# Altium schematic sheet 1_AT-Link-EZ-V1.4.schdoc
size 307 x 218 mm; Symbol: Artery_A4; Device: Artery_A4; @Project Name: AT-START-F422/F426; @Page Count: 4; @Create Date: 2025-04-14; Company: Artery Technology; Drawed: SD; Version: 1.0; Page Size: A4; @Update Date: 2025-04-14; @Page No: 1; @Schematic Name: AT-START-F426-V1.0; @Page Name: AT-Link-EZ-V1.4; Title Block Position: 3; Width: 1170; Height: 825; Region Start: 1; X Region Count: 6; Y Region Count: 4; Blade Width: 10; @Board Name: AT-START-F426-V1.0; @Create Time: 11:42:26; @Update Time: 14:57:23
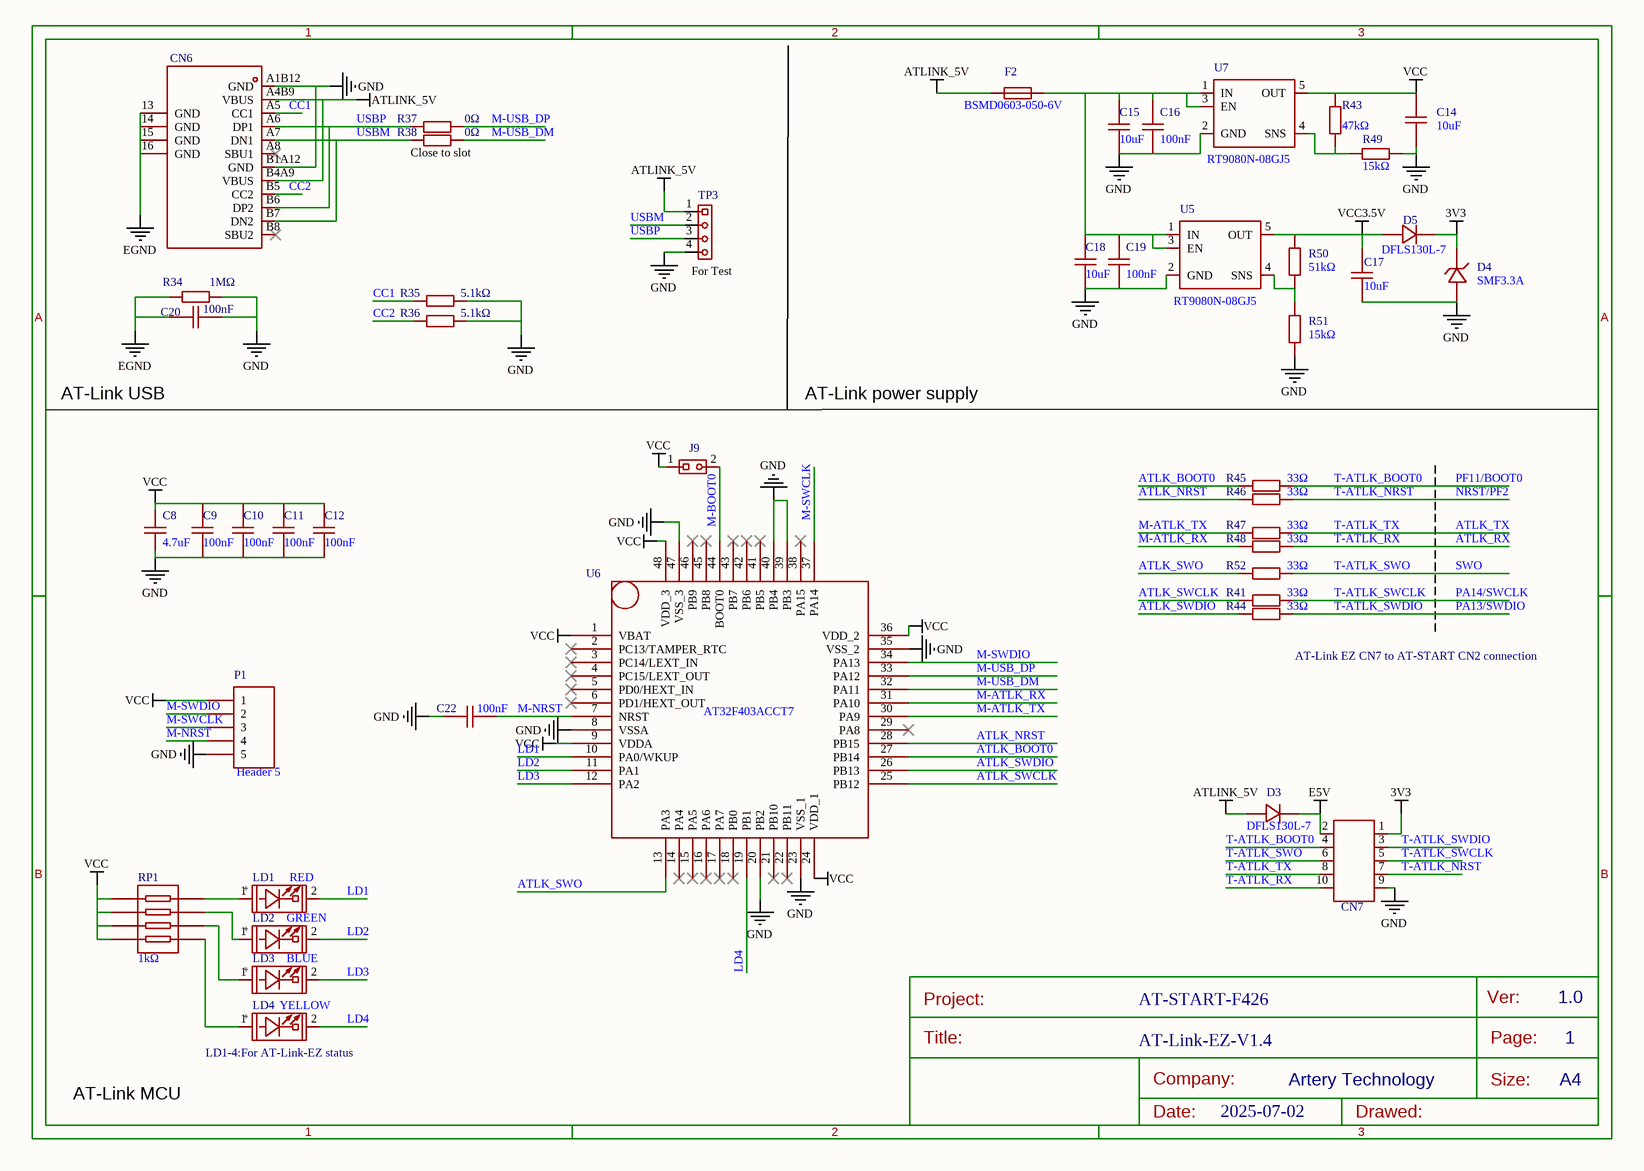
[diagram p0: 1_AT-Link-EZ-V1.4.schdoc]

## Parts
C8  4.7uF  [C0603]
C9  100nF  [C0603]
C10  100nF  [C0603]
C11  100nF  [C0603]
C12  100nF  [C0603]
C14  10uF  [C0603]
C15  10uF  [C0603]
C16  100nF  [C0603]
C17  10uF  [C0603]
C18  10uF  [C0603]
C19  100nF  [C0603]
C20  value 100nF  [C0603]
C22  100nF  [C0603]
CN6  (no value)  [USB-C-SMD_TYPEC-304-BCP16]
CN7  CON10  [HDR2X5]  (value not drawn)
D3  DFLS130L-7  [POWERDI-123_L2.8-W1.8-LS3.7-RD]
D4  SMF3.3A  [SOD-123FL_L2.8-W1.8-LS3.8-RD]
D5  DFLS130L-7  [POWERDI-123_L2.8-W1.8-LS3.7-RD]
F2  BSMD0603-050-6V  [F0603]
J9  1X2P_2.54M  [HDR1X2]  (value not drawn)
LD1  RED  [LED0603]
LD2  GREEN  [LED0603]
LD3  BLUE  [LED0603]
LD4  YELLOW  [LED0603]
P1  Header 5  [HDR1X5]
R34  value 1MΩ  [R0603]
R35  value 5.1kΩ  [R0603]
R36  value 5.1kΩ  [R0603]
R37  value 0Ω  [R0603]
R38  value 0Ω  [R0603]
R41  33Ω  [R0603]
R43  47kΩ  [R0603]
R44  33Ω  [R0603]
R45  33Ω  [R0603]
R46  33Ω  [R0603]
R47  33Ω  [R0603]
R48  33Ω  [R0603]
R49  15kΩ  [R0603]
R50  51kΩ  [R0603]
R51  15kΩ  [R0603]
R52  33Ω  [R0603]
RP1  1kΩ  [RES-ARRAY-SMD_0603-8P-L3.2-W1.6-BL]
TP3  1X4P_2.54F  [HDR1X4 - TOP]  (value not drawn)
U5  RT9080N-08GJ5  [SOT-23-5]
U6  AT32F403ACCT7  [LQFP48 - 2]
U7  RT9080N-08GJ5  [SOT-23-5]

## Nets
3V3: CN7.1 D4.1(C) D5.1
ATLINK_5V: CN6.A4B9(VBUS) CN6.B4A9(VBUS) D3.2 F2.1 TP3.1
E5V: CN7.2 D3.1
EGND: C20.2 CN6.13(GND) CN6.14(GND) CN6.15(GND) CN6.16(GND) R34.1
GND: C8.1 C9.1 C10.1 C11.1 C12.1 C14.1 C15.1 C16.1 C17.1 C18.1 C19.1 C20.1 C22.1 CN6.A1B12(GND) CN6.B1A12(GND) CN7.9 D4.2(A) P1.5 R34.2 R35.2 R36.2 R49.2 R51.2 TP3.4 U5.2(GND) U6.8(VSSA) U6.20(PB2) U6.23(VSS_1) U6.35(VSS_2) U6.39(PB3) U6.40(PB4) U6.47(VSS_3) U7.2(GND)
VCC: C8.2 C9.2 C10.2 C11.2 C12.2 C14.2 J9.1 P1.1 R43.1 RP1.1 RP1.2 RP1.3 RP1.4 U6.1(VBAT) U6.9(VDDA) U6.24(VDD_1) U6.36(VDD_2) U6.48(VDD_3) U7.5(OUT)
VCC3.5V: C17.2 D5.2 R50.1 U5.5(OUT)
ATLK_BOOT0: R45.1 U6.27(PB14)
ATLK_NRST: R46.1 U6.28(PB15)
ATLK_RX: CN7.10 R48.2  [also labelled T-ATLK_RX]
ATLK_SWCLK: R41.1 U6.25(PB12)
ATLK_SWDIO: R44.1 U6.26(PB13)
ATLK_SWO: R52.1 U6.13(PA3)
ATLK_TX: CN7.8 R47.2  [also labelled T-ATLK_TX]
CC1: CN6.A5(CC1) R35.1
CC2: CN6.B5(CC2) R36.1
LD1: LD1.2(CATHODE) U6.10(PA0/WKUP)
LD2: LD2.2(CATHODE) U6.11(PA1)
LD3: LD3.2(CATHODE) U6.12(PA2)
LD4: LD4.2(CATHODE) U6.19(PB1)
M-ATLK_RX: R48.1 U6.31(PA10)
M-ATLK_TX: R47.1 U6.30(PA9)
M-BOOT0: J9.2 U6.44(BOOT0)
M-NRST: C22.2 P1.4 U6.7(NRST)
M-SWCLK: P1.3 U6.37(PA14)
M-SWDIO: P1.2 U6.34(PA13)
M-USB_DM: R38.2 U6.32(PA11)
M-USB_DP: R37.2 U6.33(PA12)
NRST/PF2: CN7.7 R46.2  [also labelled T-ATLK_NRST]
PA13/SWDIO: CN7.3 R44.2  [also labelled T-ATLK_SWDIO]
PA14/SWCLK: CN7.5 R41.2  [also labelled T-ATLK_SWCLK]
PF11/BOOT0: CN7.4 R45.2  [also labelled T-ATLK_BOOT0]
SWO: CN7.6 R52.2  [also labelled T-ATLK_SWO]
USBM: CN6.A7(DN1) CN6.B7(DN2) R38.1 TP3.2
USBP: CN6.A6(DP1) CN6.B6(DP2) R37.1 TP3.3
NetC15_2: C15.2 C16.2 C18.2 C19.2 F2.2 U5.1(IN) U5.3(EN) U7.1(IN) U7.3(EN)
NetLD1_1: LD1.1(ANODE) RP1.8
NetLD2_1: LD2.1(ANODE) RP1.7
NetLD3_1: LD3.1(ANODE) RP1.6
NetLD4_1: LD4.1(ANODE) RP1.5
NetR43_2: R43.2 R49.1 U7.4(SNS)
NetR50_2: R50.2 R51.1 U5.4(SNS)

Not connected (* = marked no-connect by the designer): CN6 A8(SBU1)* B8(SBU2)*; U6 2(PC13/TAMPER_RTC)* 3(PC14/LEXT_IN)* 4(PC15/LEXT_OUT)* 5(PD0/HEXT_IN)* 6(PD1/HEXT_OUT)* 14(PA4)* 15(PA5)* 16(PA6)* 17(PA7)* 18(PB0)* 21(PB10)* 22(PB11)* 29(PA8)* 38(PA15)* 41(PB5)* 42(PB6)* 43(PB7)* 45(PB8)* 46(PB9)*

## Notes on the sheet
- (near R38) Close to slot
- (near TP3) For Test
- AT-Link USB
- AT-Link power supply
- AT-Link EZ CN7 to AT-START CN2 connection
- (near LD4) LD1-4:For AT-Link-EZ status
- AT-START-F426
- AT-Link MCU
- 2025-07-02
- 1
- 2
- 3
- A
- B
- Title:
- Project:
- AT-Link-EZ-V1.4
- Page:
- Ver:
- 1.0
- Date:
- Company:
- Drawed:
- Artery Technology
- Size:
- A4
- (in symbol BLUE) +
- (in symbol GREEN) +
- (in symbol RED) +
- (in symbol YELLOW) +

## Library data of the parts
C8 = CL10A475KO8NNNC: Manufacturer: SAMSUNG(三星); Add into BOM: yes; Tolerance: ±10%; Voltage Rated: 16V; Temperature Coefficient: X5R; Origin Footprint 2: 0603; Origin Footprint 3: 0402; Origin Footprint 4: C2512; Origin Footprint 5: 1608[0603]; Origin Footprint 6: C1210; Symbol: CL10A475KO8NNNC; Device: CL10A475KO8NNNC; Supplier: LCSC; Manufacturer Part: CL10A475KO8NNNC; Value: 4.7uF; Supplier Part: C19666; JLCPCB Part Class: Basic Part; LCSC Part Name: 4.7uF ±10% 16V; Supplier Footprint: 0603; Datasheet: https://atta.szlcsc.com/upload/public/pdf/source/20160218/1457707763339.pdf; Convert to PCB: yes; Origin Footprint 1: C0603; Design Item ID: Cap Semi; Library Name: PcbLib; Published: 8-Jun-2000; LatestRevisionDate: 29-May-2009; LatestRevisionNote: IPC-7351 Footprint Added.; PackageReference: C1206; Publisher: Altium Limited; PackageDescription: Chip Capacitor
C9-C12 = CC0603KRX7R9BB104: Manufacturer: YAGEO(国巨); Add into BOM: yes; Tolerance: ±10%; Voltage Rated: 50V; Temperature Coefficient: X7R; Origin Footprint 2: 0603; Origin Footprint 3: 0402; Origin Footprint 4: C2512; Origin Footprint 5: 1608[0603]; Origin Footprint 6: C1210; Symbol: CC0603KRX7R9BB104; Device: CC0603KRX7R9BB104; Supplier: LCSC; Manufacturer Part: CC0603KRX7R9BB104; Value: 100nF; Supplier Part: C14663; JLCPCB Part Class: Basic Part; LCSC Part Name: 100nF ±10% 50V; Supplier Footprint: 0603; Datasheet: https://atta.szlcsc.com/upload/public/pdf/source/20180910/C282072_33301C7F631E79921B82A8DAC6BCC5B3.pdf; Convert to PCB: yes; Origin Footprint 1: C0603; Design Item ID: Cap Semi; Library Name: PcbLib; Published: 8-Jun-2000; LatestRevisionDate: 29-May-2009; LatestRevisionNote: IPC-7351 Footprint Added.; PackageReference: C1206; Publisher: Altium Limited; PackageDescription: Chip Capacitor
C14 C15 C17 C18 = CL10A106KP8NNNC: Manufacturer: SAMSUNG(三星); Add into BOM: yes; Tolerance: ±10%; Voltage Rated: 10V; Temperature Coefficient: X5R; Symbol: CL10A106KP8NNNC; Device: CL10A106KP8NNNC; Supplier: LCSC; Manufacturer Part: CL10A106KP8NNNC; Value: 10uF; Supplier Part: C19702; JLCPCB Part Class: Basic Part; LCSC Part Name: 10uF ±10% 10V; Supplier Footprint: 0603; Datasheet: https://atta.szlcsc.com/upload/public/pdf/source/20160218/1457707763339.pdf; Convert to PCB: yes; Origin Footprint: C0603; Design Item ID: 0.1uF,50V,20%,SMD0603; Library Name: *
C16 C19 C20 C22 = CC0603KRX7R9BB104: Manufacturer: YAGEO(国巨); Add into BOM: yes; Tolerance: ±10%; Voltage Rated: 50V; Temperature Coefficient: X7R; Symbol: CC0603KRX7R9BB104; Device: CC0603KRX7R9BB104; Supplier: LCSC; Manufacturer Part: CC0603KRX7R9BB104; Supplier Part: C14663; JLCPCB Part Class: Basic Part; LCSC Part Name: 100nF ±10% 50V; Supplier Footprint: 0603; Convert to PCB: yes
  C16 C19 C22: Value: 100nF; Datasheet: https://atta.szlcsc.com/upload/public/pdf/source/20180910/C282072_33301C7F631E79921B82A8DAC6BCC5B3.pdf; Origin Footprint: C0603; Design Item ID: 0.1uF,50V,20%,SMD0603; Library Name: *
  C20: Datasheet: https://atta.szlcsc.com/upload/public/pdf/source/20170116/1484561234239.pdf
CN6 = TYPEC-304-BCP16: Manufacturer: XUNPU(讯普); Add into BOM: yes; Connector Type: Type-C; Gender: 母座; Number of Contacts: 16.0; Number of Ports: 1; Mounting Sytle: 卧贴; Current Rating - Power (Max): 3A; Welding Temperature (Max): 260; Symbol: TYPEC-304-BCP16; Device: TYPEC-304-BCP16; LCSC Part Name: TYPEC-304-BCP16; Supplier Part: C720629; Manufacturer Part: TYPEC-304-BCP16; Supplier Footprint: SMD; JLCPCB Part Class: Extended Part; Datasheet: https://atta.szlcsc.com/upload/public/pdf/source/20211022/DACD6552F639E9483017DE6DC0E61150.pdf; Supplier: LCSC; Convert to PCB: yes; Standard: USB 3.1; Operating Temperature Range: -25~+85
CN7 = CON10: Symbol: CON10A_0; Add into BOM: yes; Device: CON10; Convert to PCB: yes; Origin Footprint: HDR2X5; Design Item ID: CON10A_0; Library Name: *
D3 D5 = DFLS130L-7: Manufacturer: DIODES(美台); Add into BOM: yes; Forward Voltage (Vf@If): 310mV@1A; Reverse Voltage (Vr): 30V; Average Rectified Current (Io): 1A; Origin Footprint: SOD-123; Symbol: DFLS130L-7; Device: DFLS130L-7; LCSC Part Name: 电压:30V 电流:1A; Supplier Part: C110493; Manufacturer Part: DFLS130L-7; Supplier Footprint: Power-DI-123; JLCPCB Part Class: Extended Part; Datasheet: https://atta.szlcsc.com/upload/public/pdf/source/20170427/1493286393645.pdf; Supplier: LCSC; Convert to PCB: yes; Design Item ID: Diode; Library Name: Miscellaneous Devices; Published: 8-Jun-2000; LatestRevisionDate: 17-Jul-2002; LatestRevisionNote: Re-released for DXP Platform.; PackageVersion: Sep-1996; PackageReference: SMC; Publisher: Altium Limited; PackageDescription: DO-214-AB/SMC; 2 C-Bend Leads; Body 7.9 x 5.9 mm, inc. leads (LxW); Code_JEDEC: DO-214-AB
D4 = SMF3.3A_C2759873: Manufacturer: Leiditech(雷卯电子); Add into BOM: yes; Reverse Stand-Off Voltage (Vrwm): 3.3V; Maximum Clamping Voltage: 7.3V; Peak Pulse Current (Ipp)@10/1000us: 27.5A; Breakdown Voltage: 4.1V; Reverse Leakage Current (Ir): 500uA; Type: TVS; Origin Footprint: SOD-123; Symbol: SMF3.3A_C2759873; Device: SMF3.3A_C2759873; Supplier: LCSC; Supplier Part: C2759873; Manufacturer Part: SMF3.3A; JLCPCB Part Class: Extended Part; LCSC Part Name: SMF3.3A; Supplier Footprint: SOD-123FL; Datasheet: https://atta.szlcsc.com/upload/public/pdf/source/20210330/C2759873_54039300A94B4A929A30F4E6BEAFC556.pdf; Convert to PCB: yes; Design Item ID: Diode; Library Name: Miscellaneous Devices; Published: 8-Jun-2000; LatestRevisionDate: 17-Jul-2002; LatestRevisionNote: Re-released for DXP Platform.; PackageVersion: Sep-1996; PackageReference: SMC; Publisher: Altium Limited; PackageDescription: DO-214-AB/SMC; 2 C-Bend Leads; Body 7.9 x 5.9 mm, inc. leads (LxW); Code_JEDEC: DO-214-AB
F2 = BSMD0603-050-6V: Manufacturer: BHFUSE(佰宏); Add into BOM: yes; Operating Voltage (Max): 6V; Current Rating (Max): 40A; Hold Current: 500mA; Trip Current: 1A; Power Dissipation: 500mW; Resistance - Initial (Ri) (Min): 100mΩ; Resistance - Post Trip (R1) (Max): 800mΩ; Maximum Time to Trip: 100ms; Origin Footprint: r0603; Symbol: BSMD0603-050-6V; Device: BSMD0603-050-6V; Supplier: LCSC; Supplier Part: C883095; Manufacturer Part: BSMD0603-050-6V; JLCPCB Part Class: Extended Part; LCSC Part Name: 6V 500mA 0603自恢复; Supplier Footprint: 0603; Datasheet: https://atta.szlcsc.com/upload/public/pdf/source/20230512/E478DE3555A0061DA0124A9F45802B86.pdf; Convert to PCB: yes; Operating Temperature: -40℃~+85℃; Design Item ID: Fuse 1; Library Name: Miscellaneous Devices; Published: 8-Jun-2000; LatestRevisionDate: 17-Jul-2002; LatestRevisionNote: Re-released for DXP Platform.; PackageReference: PIN-W2/E2.8; Publisher: Altium Limited; PackageDescription: Thru-Hole; 2 Leads
J9 = 1X2P_2.54M: Symbol: 1X2P,Male,DIP_2.54; Origin Footprint 2: SIP_2P; Add into BOM: yes; Check: true; Device: 1X2P_2.54M; Convert to PCB: yes; Origin Footprint 1: HDR1X2; Design Item ID: 1X2P,Male,DIP_2.54; Library Name: *
LD1 = RED: Symbol: RED,SMD0603; Add into BOM: yes; Device: RED; Convert to PCB: yes; Origin Footprint: LED0603; Design Item ID: RED,SMD0603; Library Name: AT32F403_TINY_LQFP144_Library
LD2 = GREEN: Symbol: GREEN,SMD0603; Add into BOM: yes; Device: GREEN; Convert to PCB: yes; Origin Footprint: LED0603; Design Item ID: GREEN,SMD0603; Library Name: AT32F403_TINY_LQFP144_Library
LD3 = BLUE: Symbol: BLUE,SMD0603; Add into BOM: yes; Device: BLUE; Convert to PCB: yes; Origin Footprint: LED0603; Design Item ID: BLUE,SMD0603; Library Name: AT_START_F415
LD4 = YELLOW: Symbol: YELLOW,SMD0603; Add into BOM: yes; Device: YELLOW; Convert to PCB: yes; Origin Footprint: LED0603; Design Item ID: YELLOW,SMD0603; Library Name: Schlib1
P1 = Header 5: Add into BOM: yes; Symbol: Header 5; Device: Header 5; LatestRevisionDate: 17-Jul-2002; LatestRevisionNote: Re-released for DXP Platform.; Publisher: Altium Limited; Convert to PCB: yes; Origin Footprint: HDR1X5; Design Item ID: Header 5; Library Name: Miscellaneous Connectors
R34 = RC0603FR-071ML: Manufacturer: YAGEO(国巨); Add into BOM: yes; Tolerance: ±1%; Power(Watts): 100mW; Temperature Coefficient: ±100ppm/; Overload Voltage (Max): 75V; Symbol: RC0603FR-071ML; Device: RC0603FR-071ML; LCSC Part Name: 1MΩ ±1%; Supplier Part: C105578; Manufacturer Part: RC0603FR-071ML; Supplier Footprint: 0603; JLCPCB Part Class: Extended Part; Datasheet: https://atta.szlcsc.com/upload/public/pdf/source/20181102/C105578_67A9388250AF143DE4682E62257D2969.pdf; Supplier: LCSC; Convert to PCB: yes; Operating Temperature Range: -55~+155
R35 R36 = 0603WAF5101T5E: Manufacturer: UNI-ROYAL(厚声); Add into BOM: yes; Tolerance: ±1%; Power(Watts): 1/10W; Temperature Coefficient: ±100ppm/; Overload Voltage (Max): 75V; Symbol: 0603WAF5101T5E; Device: 0603WAF5101T5E; LCSC Part Name: 5.1kΩ ±1%; Supplier Part: C23186; Manufacturer Part: 0603WAF5101T5E; Supplier Footprint: 0603; JLCPCB Part Class: Basic Part; Datasheet: https://atta.szlcsc.com/upload/public/pdf/source/20200306/C422600_1E6D84923E4A46A82E41ADD87F860B5C.pdf; Supplier: LCSC; Convert to PCB: yes; Type: 厚膜电阻; Operating Temperature Range: -55~+155
R37 R38 = 0603WAF0000T5E: Manufacturer: UNI-ROYAL(厚声); Add into BOM: yes; Tolerance: ±1%; Power(Watts): 1/10W; Overload Voltage (Max): 75V; Symbol: 0603WAF0000T5E; Device: 0603WAF0000T5E; LCSC Part Name: 0Ω ±1%; Supplier Part: C21189; Manufacturer Part: 0603WAF0000T5E; Supplier Footprint: 0603; JLCPCB Part Class: Basic Part; Datasheet: https://atta.szlcsc.com/upload/public/pdf/source/20200306/C422600_1E6D84923E4A46A82E41ADD87F860B5C.pdf; Supplier: LCSC; Convert to PCB: yes; Type: 厚膜电阻; Temperature Coefficient: -; Operating Temperature Range: -55~+155
R41 R44-R48 R52 = 0603WAF330JT5E: Manufacturer: UNI-ROYAL(厚声); Add into BOM: yes; Tolerance: ±1%; Power(Watts): 100mW; Overload Voltage (Max): 75V; Temperature Coefficient: ±100ppm/℃; Symbol: 0603WAF330JT5E; Device: 0603WAF330JT5E; Supplier: LCSC; Manufacturer Part: 0603WAF330JT5E; Supplier Part: C23140; Value: 33Ω; JLCPCB Part Class: Basic Part; LCSC Part Name: 33Ω ±1% 100mW 厚膜电阻; Supplier Footprint: 0603; Datasheet: https://atta.szlcsc.com/upload/public/pdf/source/20200306/C422600_1E6D84923E4A46A82E41ADD87F860B5C.pdf; Convert to PCB: yes; Type: 厚膜电阻; Operating Temperature Range: -55℃~+155℃; Origin Footprint: R0603; Design Item ID: 22,1/10W,1%,SMD0603; Library Name: *
R43 = 0603WAF4702T5E: Manufacturer: UNI-ROYAL(厚声); Add into BOM: yes; Tolerance: ±1%; Power(Watts): 100mW; Overload Voltage (Max): 75V; Temperature Coefficient: ±100ppm/℃; Symbol: 0603WAF4702T5E; Device: 0603WAF4702T5E; Supplier: LCSC; Manufacturer Part: 0603WAF4702T5E; Supplier Part: C25819; Value: 47kΩ; JLCPCB Part Class: Basic Part; LCSC Part Name: 47kΩ ±1% 100mW 厚膜电阻; Supplier Footprint: 0603; Datasheet: https://atta.szlcsc.com/upload/public/pdf/source/20200306/C422600_1E6D84923E4A46A82E41ADD87F860B5C.pdf; Convert to PCB: yes; Type: 厚膜电阻; Operating Temperature Range: -55℃~+155℃; Origin Footprint: R0603; Design Item ID: 470,1/10W,1%,SMD0603; Library Name: *
R49 R51 = 0603WAF1502T5E: Manufacturer: UNI-ROYAL(厚声); Add into BOM: yes; Tolerance: ±1%; Power(Watts): 100mW; Overload Voltage (Max): 75V; Temperature Coefficient: ±100ppm/℃; Symbol: 0603WAF1502T5E; Device: 0603WAF1502T5E; Supplier: LCSC; Manufacturer Part: 0603WAF1502T5E; Supplier Part: C22809; Value: 15kΩ; JLCPCB Part Class: Basic Part; LCSC Part Name: 15kΩ ±1% 100mW 厚膜电阻; Supplier Footprint: 0603; Datasheet: https://atta.szlcsc.com/upload/public/pdf/source/20200306/C422600_1E6D84923E4A46A82E41ADD87F860B5C.pdf; Convert to PCB: yes; Type: 厚膜电阻; Operating Temperature Range: -55℃~+155℃; Origin Footprint: R0603; Design Item ID: 470,1/10W,1%,SMD0603; Library Name: *
R50 = 0603WAF5102T5E: Manufacturer: UNI-ROYAL(厚声); Add into BOM: yes; Tolerance: ±1%; Power(Watts): 100mW; Overload Voltage (Max): 75V; Temperature Coefficient: ±100ppm/℃; Symbol: 0603WAF5102T5E; Device: 0603WAF5102T5E; Supplier: LCSC; Manufacturer Part: 0603WAF5102T5E; Supplier Part: C23196; Value: 51kΩ; JLCPCB Part Class: Basic Part; LCSC Part Name: 51kΩ ±1% 100mW 厚膜电阻; Supplier Footprint: 0603; Datasheet: https://atta.szlcsc.com/upload/public/pdf/source/20200306/C422600_1E6D84923E4A46A82E41ADD87F860B5C.pdf; Convert to PCB: yes; Type: 厚膜电阻; Operating Temperature Range: -55℃~+155℃; Origin Footprint: R0603; Design Item ID: 470,1/10W,1%,SMD0603; Library Name: *
RP1 = 4D03WGJ0102T5E: Manufacturer: UNI-ROYAL(厚声); Add into BOM: yes; Number of Resistors: 4; Tolerance: ±5%; Power(Watts): 62.5mW; Temperature Coefficient: ±200ppm/℃; Origin Footprint: RP_4-0603; Symbol: 4D03WGJ0102T5E; Device: 4D03WGJ0102T5E; Supplier: LCSC; Manufacturer Part: 4D03WGJ0102T5E; Supplier Part: C20197; Value: 1kΩ; JLCPCB Part Class: Basic Part; LCSC Part Name: 1kΩ ±5%; Supplier Footprint: 0603x4; Datasheet: https://atta.szlcsc.com/upload/public/pdf/source/20191224/C474318_2527498AE30E813171187CCD28401A71.pdf; Convert to PCB: yes; Number of Pins: 8; Design Item ID: 22,1/16W,5%,8P4R; Library Name: *
TP3 = 1X4P_2.54F: Convert to PCB: yes; Symbol: 1X4P_2.54F; Device: 1X4P_2.54F; Add into BOM: yes; Origin Footprint: HDR1X4 - TOP
U5 U7 = RT9080N-08GJ5: Add into BOM: yes; Symbol: RT9080N; Device: RT9080N-08GJ5; Convert to PCB: yes; Origin Footprint: SOT-23-5; Design Item ID: RT9080N; Library Name: SCM_START_402F
U6 = AT32F403CGT6: Symbol: LQFP48&QFN48; Add into BOM: yes; Device: AT32F403CGT6; Convert to PCB: yes; Origin Footprint: LQFP48 - 2; Design Item ID: LQFP48&amp;QFN48; Library Name: AT403-ALL-Package